# EasyEDA Pro project ProPrj_supercap v0.1_2026-02-15.epro, schematic Schematic1, sheets 4 to 5 of 5

## Sheets
4 P4: Project Name: Project Name; Schematic Name: Schematic Name; Update Date: 2021.11.05
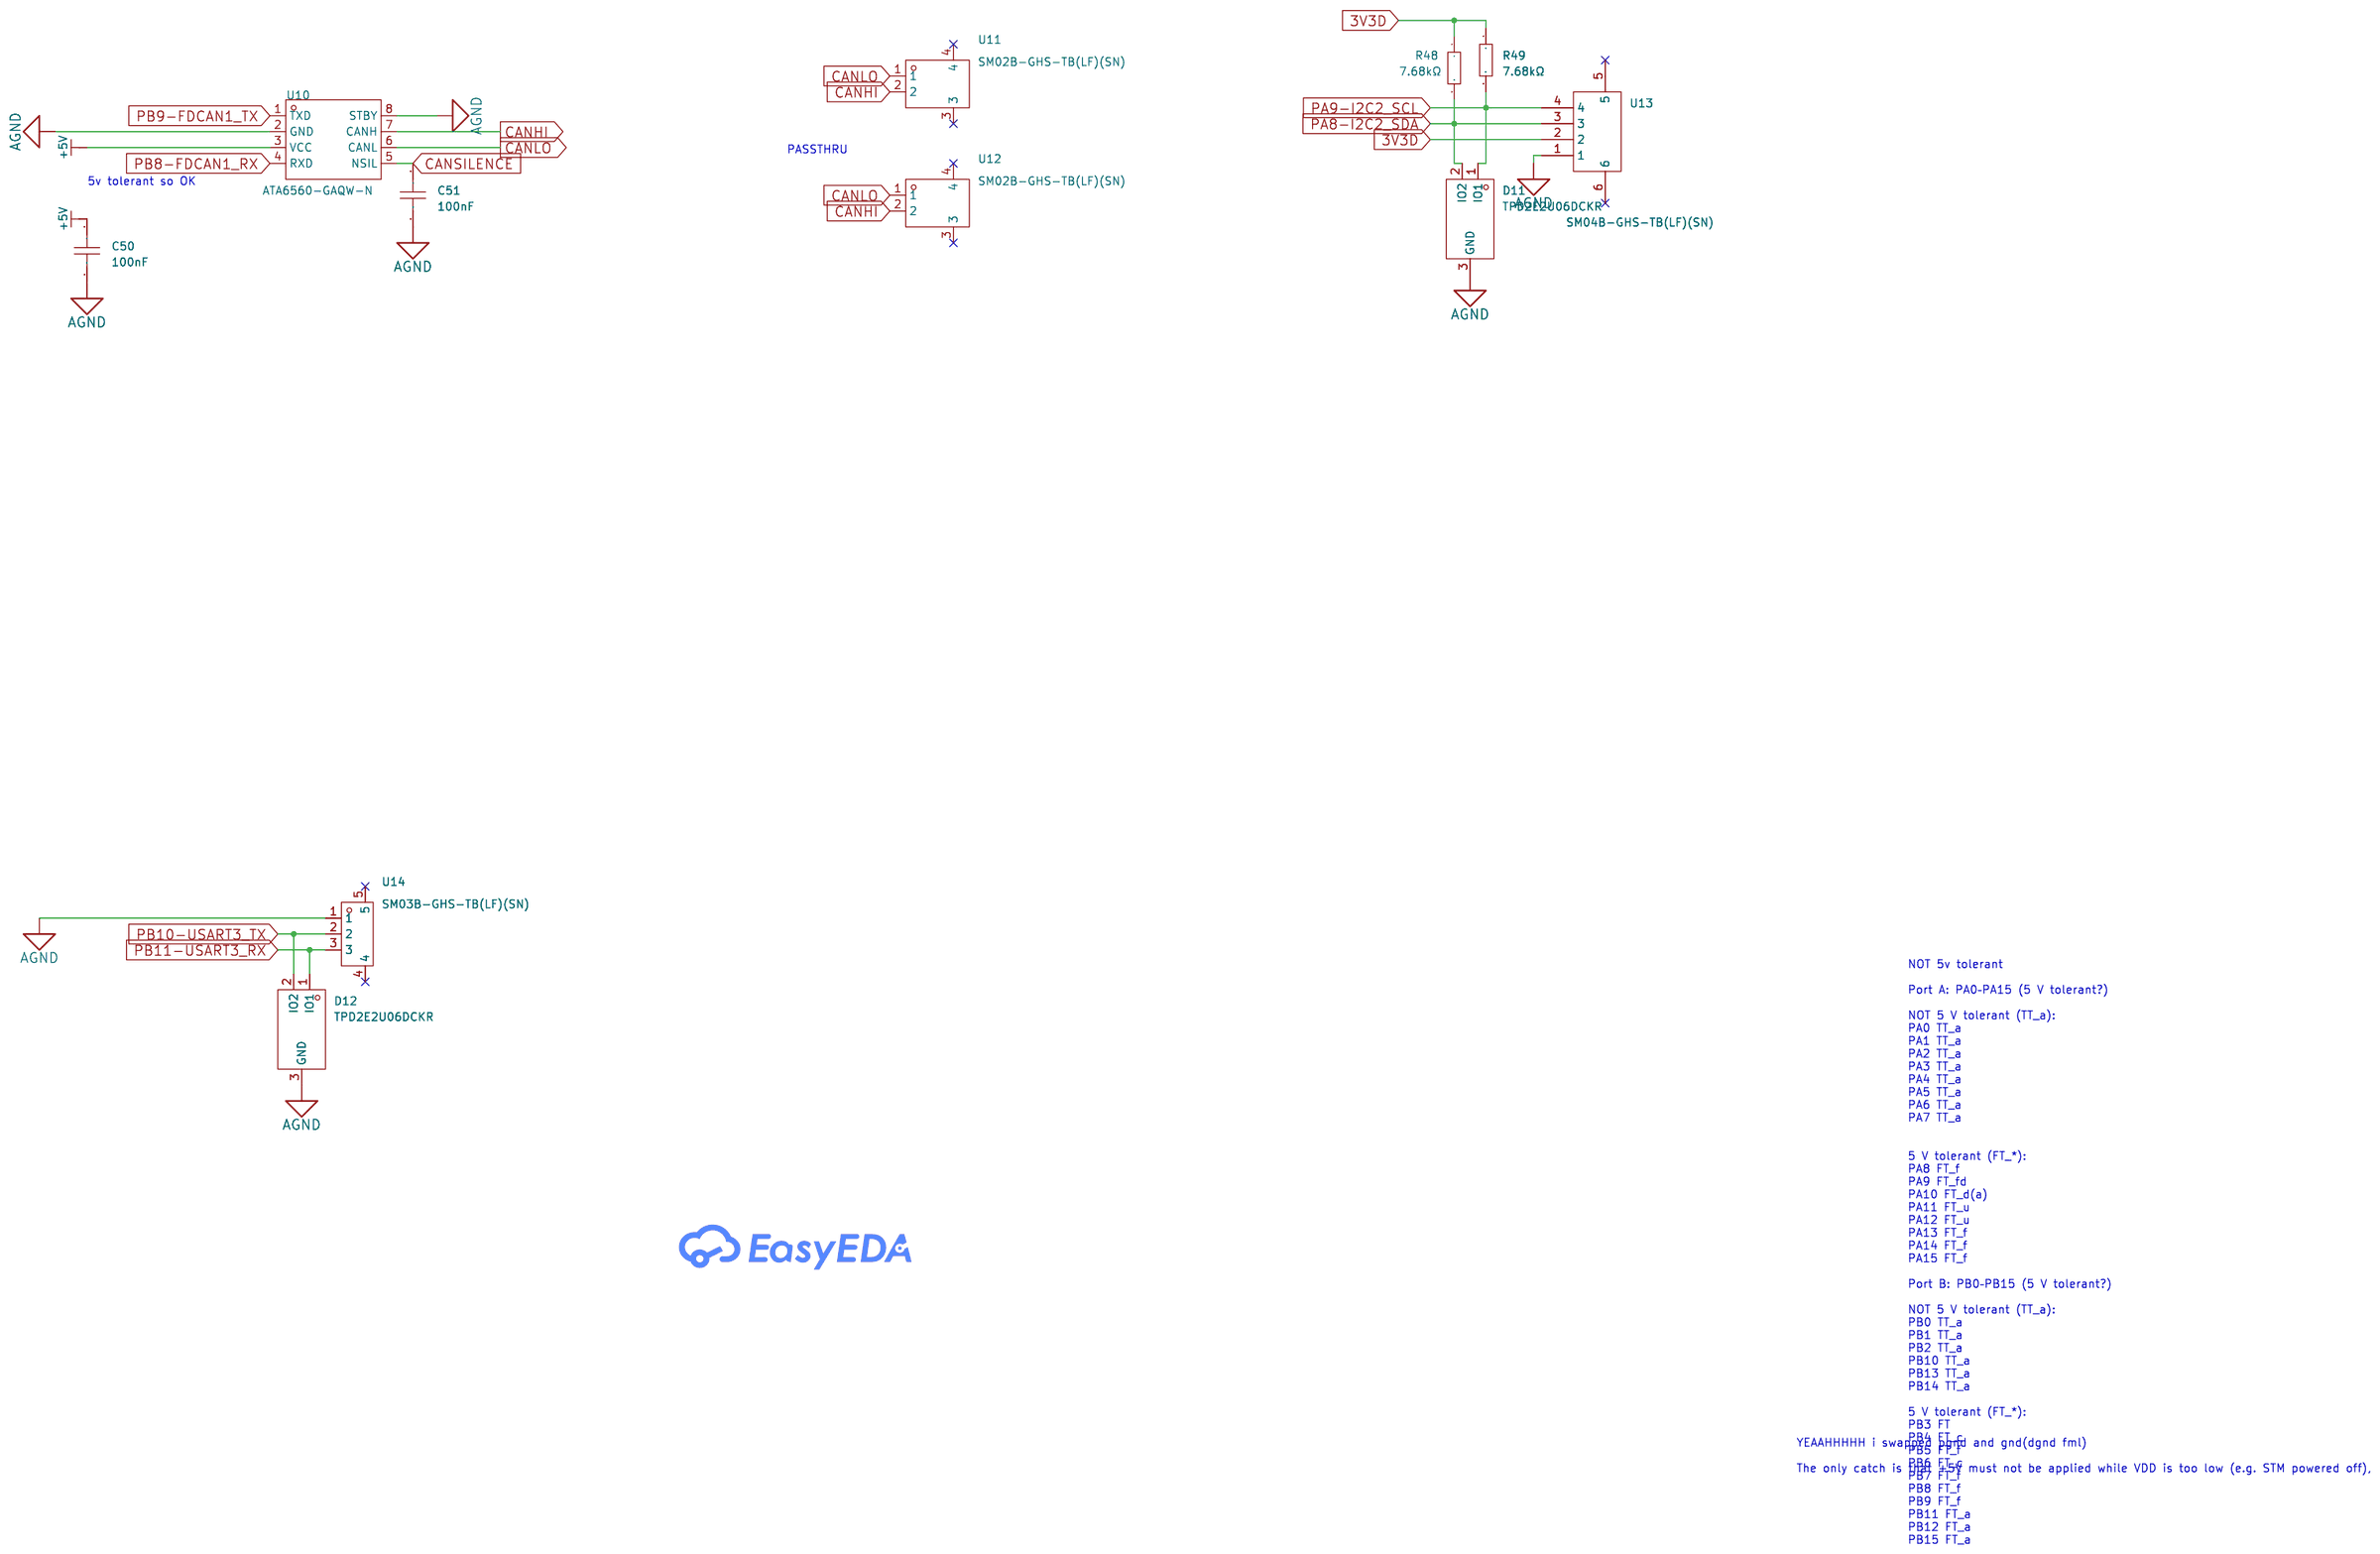
[diagram p3: P4]
5 P5: Create Date: 2026-01-09; Page Name: P5; Update Date: 2026-01-31
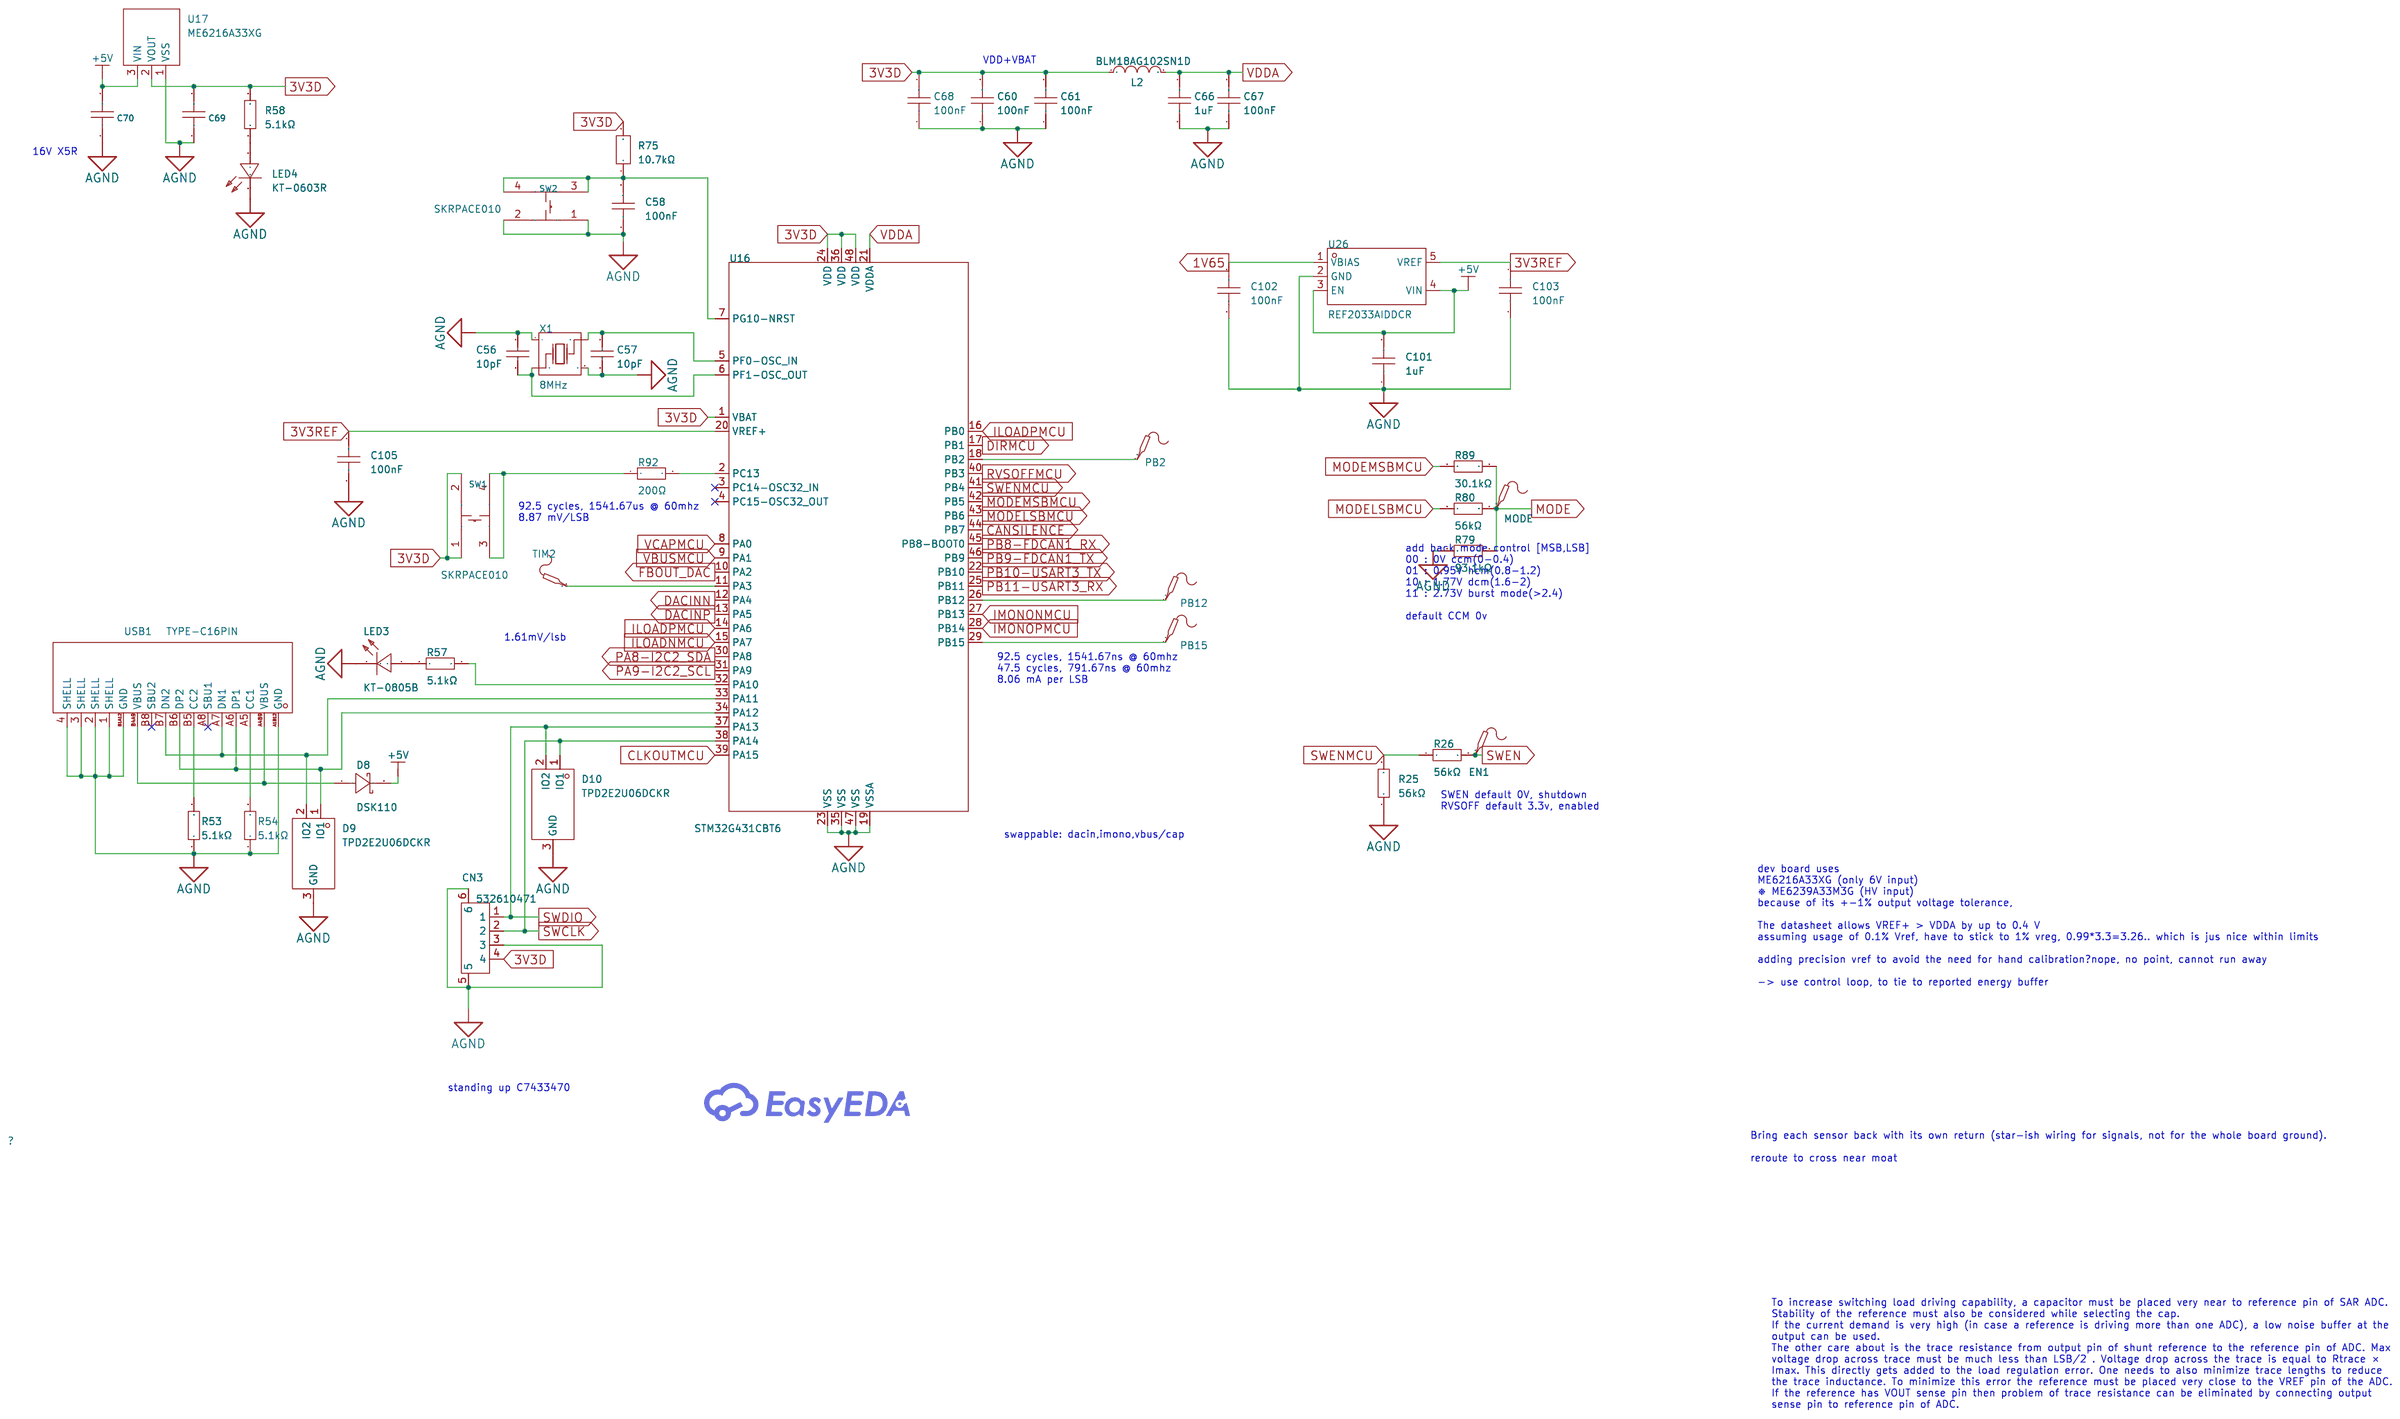
[diagram p4: P5]

## Parts
sheet P4
C50  100nF  [C0603]
C51  100nF  [C0603]
D11  TPD2E2U06DCKR  [SC-70-3_L2.0-W1.3-P0.65-LS2.1-BL]
D12  TPD2E2U06DCKR  [SC-70-3_L2.0-W1.3-P0.65-LS2.1-BL]
R48  7.68kΩ  [R0603]
R49  7.68kΩ  [R0603]
U10  ATA6560-GAQW-N  [SOP-8_L4.9-W3.9-P1.27-LS6.0-BL]
U11  SM02B-GHS-TB(LF)(SN)  [CONN-SMD_SM02B-GHS-TB-LF-SN]
U12  SM02B-GHS-TB(LF)(SN)  [CONN-SMD_SM02B-GHS-TB-LF-SN]
U13  SM04B-GHS-TB(LF)(SN)  [CONN-SMD_4P-P1.25_SM04B-GHS-TB-LF-SN]
U14  SM03B-GHS-TB(LF)(SN)  [CONN-TH_SM03B-GHS-TB-LF-SN]
sheet P5
C56  10pF  [C0603]
C57  10pF  [C0603]
C58  100nF  [C0603]
C60  100nF  [C0603]
C61  100nF  [C0603]
C66  1uF  [C0603]
C67  100nF  [C0603]
C68  100nF  [C0603]
C69  4.7uF  [C0805]
C70  4.7uF  [C0805]
C101  1uF  [C0603]
C102  100nF  [C0603]
C103  100nF  [C0603]
C105  100nF  [C0603]
CN3  532610471  [CONN-SMD_4P-P1.25_53261-0471]
D8  DSK110  [SOD-123_L2.8-W1.8-LS3.7-FD]
D9  TPD2E2U06DCKR  [SC-70-3_L2.0-W1.3-P0.65-LS2.1-BL]
D10  TPD2E2U06DCKR  [SC-70-3_L2.0-W1.3-P0.65-LS2.1-BL]
EN1  -  [Test-Point-0.5mm]
L2  BLM18AG102SN1D  [L0603]
LED3  KT-0805B  [LED0805-R-RD]
LED4  KT-0603R  [LED0603-RD]
MODE  -  [Test-Point-0.5mm]
PB2  -  [Test-Point-0.5mm]
PB12  -  [Test-Point-0.5mm]
PB15  -  [Test-Point-0.5mm]
R25  56kΩ  [R0603]
R26  56kΩ  [R0603]
R53  5.1kΩ  [R0603]
R54  5.1kΩ  [R0603]
R57  5.1kΩ  [R0603]
R58  5.1kΩ  [R0603]
R75  10.7kΩ  [R0603]
R79  93.1kΩ  [R0603]
R80  56kΩ  [R0603]
R89  30.1kΩ  [R0603]
R92  200Ω  [R0603]
SW1  SKRPACE010  [KEY-SMD_4P-L4.2-W3.2-P2.20-LS4.6]
SW2  SKRPACE010  [KEY-SMD_4P-L4.2-W3.2-P2.20-LS4.6]
TIM2  -  [Test-Point-0.5mm]
U16  STM32G431CBT6  [LQFP-48_L7.0-W7.0-P0.50-LS9.0-BL]
U17  ME6216A33XG  [SOT-23-3_L2.9-W1.6-P1.90-LS2.8-BR]
U26  REF2033AIDDCR  [SOT-23-5_L3.0-W1.7-P0.95-LS2.8-BL]
USB1  TYPE-C16PIN  [USB-C-SMD_TYPE-C16PIN]
X1  8MHz  [CRYSTAL-SMD_4P-L3.2-W2.5-BL]

## Library data of the parts
C50 C51 C58 C60 C61 C67 C68 C102 C103 C105 = CL10B104KC8NNNC: Capacitance:100nF Tolerance:±10% Tolerance:±10% Voltage Rating:100V Temperature Coefficient:X7R; LCSC Part Name: 100nF ±10% 100V; Supplier Part: C15725; Manufacturer: SAMSUNG(三星); Supplier Footprint: 0603; JLCPCB Part Class: Extended Part; Datasheet: https://item.szlcsc.com/datasheet/CL10B104KC8NNNC/16407.html; Supplier: LCSC; Tolerance: ±10%; Voltage Rating: 100V; Temperature Coefficient: X7R; Check: true
D9-D12 = TPD2E2U06DCKR: Reverse Stand-Off Voltage (Vrwm):5.5V Maximum Clamping Voltage:12.4V Peak Pulse Current (Ipp):5.5A@8/20us Peak Pulse Power Dissipation (Ppp):75W Breakdown Voltage:6.5V Number of Lines:Dual channel Operating Temperature:-40℃~+125℃@(Ta) Operating Temperatur; Supplier Part: C1855726; Manufacturer: TI(德州仪器); Supplier Footprint: SC-70-3; JLCPCB Part Class: Extended Part; Datasheet: https://www.ti.com/cn/lit/gpn/tpd2e2u06; Supplier: LCSC; Reverse Stand-Off Voltage (Vrwm): 5.5V; Maximum Clamping Voltage: 12.4V; Peak Pulse Current (Ipp): 5.5A@8/20us; Peak Pulse Power Dissipation (Ppp): 75W; Breakdown Voltage: 6.5V; Number of Lines: Dual channel; Operating Temperature: -40℃~+125℃@(Ta); Type: ESD
R48 R49 = RT0603BRD077K68L: Type:Thin Film Resistor Resistance: Tolerance:±0.1% Tolerance:±0.1% Power(Watts): Overload Voltage (Max): Temperature Coefficient:±25ppm/℃ Temperature Coefficient:±25ppm/℃ Operating Temperature Range:-55℃~+155℃ Operating Temperature Range:-55℃~+155℃; LCSC Part Name: 薄膜电阻 7.68kΩ ±0.1% 100mW; Supplier Part: C375517; Manufacturer: YAGEO(国巨); Supplier Footprint: 0603; JLCPCB Part Class: Extended Part; Datasheet: https://atta.szlcsc.com/upload/public/pdf/source/20190227/C375517_CC2D9037C5877ACA9CB8399CF9A8D04C.pdf; Supplier: LCSC; Type: Thin Film Resistor; Tolerance: ±0.1%; Temperature Coefficient: ±25ppm/℃; Operating Temperature Range: -55℃~+155℃; Check: true
U10 = ATA6560-GAQW-N_C2671262: Type:CANtransceiver Data Rate:5Mbps Supply Voltage:4.5V~5.5V Supply Voltage:4.5V~5.5V Operating Temperature:-40℃~+150℃ Operating Temperature:-40℃~+150℃; LCSC Part Name: 高速CAN收发器，具有待机模式; Supplier Part: C2671262; Manufacturer: MICROCHIP(美国微芯); Supplier Footprint: SOP-8; JLCPCB Part Class: Extended Part; Datasheet: https://atta.szlcsc.com/upload/public/pdf/source/20211008/C2671262_D7FCCB811013C7D69A57B5A2D230BAD0.pdf; Supplier: LCSC; Type: CANtransceiver; Data Rate: 5Mbps; Supply Voltage: 4.5V~5.5V; Operating Temperature: -40℃~+150℃; Check: true
U11 U12 = SM02B-GHS-TB(LF)(SN): Pins Structure:1x2P Pitch:1.25mm Mounting Style:Horizontal attachment Reference Series:GH Number of Pins:2P Number of Rows:1 Number of PINs Per Row:2 Row Spacing:- Current Rating (Max):1A Contact Material:Phosphor Bronze Contact Plating:Tin Operating Temp; LCSC Part Name: 1x2P 间距:1.25mm 卧贴 系列:GH; Supplier Part: C189893; Manufacturer: JST; Supplier Footprint: SMD,P=1.25mm,卧贴; JLCPCB Part Class: Extended Part; Datasheet: https://atta.szlcsc.com/upload/public/pdf/source/20180323/112205B2CF875947C9562BFC7B01FA26.pdf; Supplier: LCSC; Pins Structure: 1x2P; Pitch: 1.25mm; Mounting Style: Horizontal attachment; Reference Series: GH; Number of Pins: 2P; Number of Rows: 1; Number of PINs Per Row: 2; Current Rating (Max): 1A; Contact Material: Phosphor Bronze; Contact Plating: Tin; Operating Temperature Range: -25℃~+85℃; Rated Voltage (Max): 50V; Plastic Material: PA9T; Flame Retardant Rating: UL94V-0; Supplementary Features: Auxiliary soldering legs; Colour: White; Z-Height of the Board: 4.25mm; X-Length of Bottom Edge on Board (Spacing Line): 5.75mm; Y-Width of Bottom Edge on Board: 4.13mm; Check: true
U13 = SM04B-GHS-TB(LF)(SN): Pins Structure:1x4P Pitch:1.25mm Mounting Style:Horizontal attachment Reference Series:GH Number of Pins:4P Number of Rows:1 Number of PINs Per Row:4 Row Spacing:- Current Rating (Max):1A Contact Material:Phosphor Bronze Contact Plating:Tin Operating Temp; LCSC Part Name: 1x4P 间距:1.25mm 卧贴 系列:GH; Supplier Part: C189895; Manufacturer: JST; Supplier Footprint: SMD,P=1.25mm,卧贴; JLCPCB Part Class: Extended Part; Datasheet: https://atta.szlcsc.com/upload/public/pdf/source/20180323/112205B2CF875947C9562BFC7B01FA26.pdf; Supplier: LCSC; Pins Structure: 1x4P; Pitch: 1.25mm; Mounting Style: Horizontal attachment; Reference Series: GH; Number of Pins: 4P; Number of Rows: 1; Number of PINs Per Row: 4; Current Rating (Max): 1A; Contact Material: Phosphor Bronze; Contact Plating: Tin; Operating Temperature Range: -25℃~+85℃; Rated Voltage (Max): 50V; Plastic Material: PA9T; Flame Retardant Rating: UL94V-0; Supplementary Features: Auxiliary soldering legs; Colour: White; Z-Height of the Board: 4.25mm; X-Length of Bottom Edge on Board (Spacing Line): 8.25mm; Y-Width of Bottom Edge on Board: 4.13mm; Check: true
U14 = SM03B-GHS-TB(LF)(SN): Pins Structure:1x3P Pitch:1.25mm Mounting Style:Horizontal attachment Reference Series:GH Number of Pins:3P Number of Rows:1 Number of PINs Per Row:3 Row Spacing:- Current Rating (Max):1A Contact Material:Phosphor Bronze Contact Plating:Tin Operating Temp; LCSC Part Name: 1x3P 间距:1.25mm 卧贴 系列:GH; Supplier Part: C514175; Manufacturer: JST; Supplier Footprint: SMD,P=1.25mm,卧贴; JLCPCB Part Class: Extended Part; Datasheet: https://atta.szlcsc.com/upload/public/pdf/source/20200416/C514175_6D761544780BFF1FCAB26BE8A747A99F.pdf; Supplier: LCSC; Pins Structure: 1x3P; Pitch: 1.25mm; Mounting Style: Horizontal attachment; Reference Series: GH; Number of Pins: 3P; Number of Rows: 1; Number of PINs Per Row: 3; Current Rating (Max): 1A; Contact Material: Phosphor Bronze; Contact Plating: Tin; Operating Temperature Range: -25℃~+85℃; Rated Voltage (Max): 50V; Plastic Material: PA9T; Flame Retardant Rating: UL94V-0; Supplementary Features: Auxiliary soldering legs; Colour: White; Z-Height of the Board: 4.25mm; X-Length of Bottom Edge on Board (Spacing Line): 7mm; Y-Width of Bottom Edge on Board: 4.13mm; Check: true
C56 C57 = CL10C100JB8NNNC: Capacitance:10pF Tolerance:±5% Tolerance:±5% Voltage Rating:50V Temperature Coefficient:C0G; LCSC Part Name: 10pF ±5% 50V; Supplier Part: C1634; Manufacturer: SAMSUNG(三星); Supplier Footprint: 0603; JLCPCB Part Class: Basic Part; Datasheet: https://item.szlcsc.com/datasheet/CL10C100JB8NNNC/1986.html; Supplier: LCSC; Tolerance: ±5%; Voltage Rating: 50V; Temperature Coefficient: C0G; Check: true
C66 C101 = CC0603KRX7R9BB105: Capacitance: Tolerance:±10% Tolerance:±10% Voltage Rated: Temperature Coefficient:; LCSC Part Name: 1uF ±10% 50V; Supplier Part: C559769; Manufacturer: YAGEO(国巨); Supplier Footprint: 0603; JLCPCB Part Class: Extended Part; Datasheet: https://atta.szlcsc.com/upload/public/pdf/source/20181031/C325451_C7CF01155AE3010E0D610C52F5FE7D31.pdf; Supplier: LCSC; Tolerance: ±10%; Check: true
C69 C70 = GRM21BZ71H475KE15L: Capacitance:4.7uF Tolerance:±10% Tolerance:±10% Voltage Rating:50V Temperature Coefficient:X7R; LCSC Part Name: 4.7uF ±10% 50V; Supplier Part: C437557; Manufacturer: muRata(村田); Supplier Footprint: 0805; JLCPCB Part Class: Extended Part; Datasheet: https://item.szlcsc.com/datasheet/GRM21BZ71H475KE15L/436012.html; Supplier: LCSC; Tolerance: ±10%; Voltage Rating: 50V; Temperature Coefficient: X7R
CN3 = 532610471_C696092: Pins Structure:1x4P Pitch:1.25mm Mounting Style:Horizontal attachment Reference Series:PicoBlade(MX 1.25) Number of Pins:4P Number of Rows:1 Number of PINs Per Row:4 Row Spacing:- Current Rating (Max):1A Contact Material:Phosphor Bronze Contact Plating:Ti; LCSC Part Name: 1x4P 间距:1.25mm 卧贴 系列:PicoBlade(MX 1.25); Supplier Part: C696092; Manufacturer: MOLEX; Supplier Footprint: SMD,P=1.25mm; JLCPCB Part Class: Extended Part; Datasheet: https://www.molex.com/content/dam/molex/molex-dot-com/products/automated/en-us/salesdrawingpdf/532/53261/532610471_sd.pdf?inline; Supplier: LCSC; Pins Structure: 1x4P; Pitch: 1.25mm; Mounting Style: Horizontal attachment; Reference Series: PicoBlade(MX 1.25); Number of Pins: 4P; Number of Rows: 1; Number of PINs Per Row: 4; Current Rating (Max): 1A; Contact Material: Phosphor Bronze; Contact Plating: Tin; Operating Temperature Range: -40℃~+105℃; Rated Voltage (Max): 125V; Plastic Material: 玻纤增强PA; Flame Retardant Rating: UL94V-0; Supplementary Features: Auxiliary soldering legs; Colour: White; Z-Height of the Board: 3.4mm; X-Length of Bottom Edge on Board (Spacing Line): 10.15mm; Y-Width of Bottom Edge on Board: 5.2mm; Check: true
D8 = DSK110_C908227: Diode Configuration:- Voltage - Forward(Vf@If):850mV@1A Voltage - DC Reverse(Vr):100V Current - Rectified:1A Reverse Leakage Current (Ir):500nA Operating Junction Temperature Range:-55℃~+150℃ Operating Junction Temperature Range:-55℃~+150℃ Non-Repetitive; LCSC Part Name: 电压:100V 电流:1A; Supplier Part: C908227; Manufacturer: FUXINSEMI(富芯森美); Supplier Footprint: SOD-123; JLCPCB Part Class: Extended Part; Datasheet: https://item.szlcsc.com/datasheet/DSK110/974469.html; Supplier: LCSC; Forward Voltage (Vf@If): 850mV@1A; Reverse Voltage (Vr): 100V; Rectified Current: 1A; Reverse Leakage Current (Ir): 500nA; Voltage - Forward(Vf@If): 850mV@1A; Voltage - DC Reverse(Vr): 100V; Current - Rectified: 1A; Non-Repetitive Peak Forward Surge Current: 25A; Operating Junction Temperature Range: -55℃~+150℃
EN1 = Test-Point: Test Point 测试点; Check: true
L2 = BLM18AG102SN1D: Impedance @ Frequency:1kΩ@100MHz Tolerance:±25% Tolerance:±25% DC Resistance:500mΩ Current Rating:450mA Circuits:1; LCSC Part Name: 单路 0603磁珠 阻抗1kΩ@100MHz; Supplier Part: C85824; Manufacturer: muRata(村田); Supplier Footprint: 0603; JLCPCB Part Class: Extended Part; Datasheet: https://atta.szlcsc.com/upload/public/pdf/source/20180329/C160981_FD3C2D2622A377E203B89F4AA32B0741.pdf; Supplier: LCSC; Impedance @ Frequency: 1kΩ@100MHz; Tolerance: ±25%; DC Resistance: 500mΩ; Current Rating: 450mA; Circuits: 1
LED3 = KT-0805B: LCSC Part Name: 0805 蓝灯 高亮; Supplier Part: C2293; Manufacturer: KENTO; Supplier Footprint: 0805; JLCPCB Part Class: Extended Part; Datasheet: https://atta.szlcsc.com/upload/public/pdf/source/20150723/1457707334170.pdf; Supplier: LCSC
LED4 = KT-0603R: Emitted Color:Red Power Dissipation:- Forward Current:- Dominant Wavelength:- Dominant Wavelength:- Peak Wavelength:- Diode Configuration:- Lens Color:- Color Temperature:- Color Temperature:- Viewing Angle:- Mounting Sytle:- Operating Temperature:-40℃~+8; LCSC Part Name: 0603 红灯 高亮; Supplier Part: C2286; Manufacturer: KENTO; Supplier Footprint: 0603; JLCPCB Part Class: Basic Part; Datasheet: https://atta.szlcsc.com/upload/public/pdf/source/20160616/1466072038404.pdf; Supplier: LCSC; Emitted Color: Red; Operating Temperature: -40℃~+85℃
MODE PB2 PB12 PB15 TIM2 = Test-Point: Test Point 测试点
R25 R26 R80 = RC0603FR-0756KL: Type:Thick Film Resistors Resistance: Tolerance:±1% Tolerance:±1% Power(Watts): Overload Voltage (Max): Temperature Coefficient:±100ppm/℃ Temperature Coefficient:±100ppm/℃ Operating Temperature Range:-55℃~+155℃ Operating Temperature Range:-55℃~+155℃; LCSC Part Name: 厚膜电阻 56kΩ ±1% 100mW; Supplier Part: C114630; Manufacturer: YAGEO(国巨); Supplier Footprint: 0603; JLCPCB Part Class: Extended Part; Datasheet: https://atta.szlcsc.com/upload/public/pdf/source/20180821/C275644_0D56F95EFF785E7D9A1FEF436B37DA78.pdf; Supplier: LCSC; Type: Thick Film Resistors; Tolerance: ±1%; Temperature Coefficient: ±100ppm/℃; Operating Temperature Range: -55℃~+155℃
R53 R54 R57 R58 = RC0603FR-075K1L: Type:Thick Film Resistors Resistance:5.1kΩ Tolerance:±1% Tolerance:±1% Power(Watts):100mW Voltage-Supply(Max):75V Temperature Coefficient:±100ppm/℃ Temperature Coefficient:±100ppm/℃ Operating Temperature:-55℃~+155℃ Operating Temperature:-55℃~+155℃; LCSC Part Name: 厚膜电阻 5.1kΩ ±1% 100mW; Supplier Part: C105580; Manufacturer: YAGEO(国巨); Supplier Footprint: 0603; JLCPCB Part Class: Extended Part; Datasheet: https://item.szlcsc.com/datasheet/RC0603FR-075K1L/106795.html; Supplier: LCSC; Type: Thick Film Resistors; Tolerance: ±1%; Power(Watts): 100mW; Voltage-Supply(Max): 75V; Temperature Coefficient: ±100ppm/℃; Operating Temperature: -55℃~+155℃
R75 = RC0603FR-0710K7L: Type:Thick Film Resistors Resistance: Tolerance:±1% Tolerance:±1% Power(Watts): Overload Voltage (Max): Temperature Coefficient:±100ppm/℃ Temperature Coefficient:±100ppm/℃ Operating Temperature Range:-55℃~+155℃ Operating Temperature Range:-55℃~+155℃; LCSC Part Name: 厚膜电阻 10.7kΩ ±1% 100mW; Supplier Part: C482766; Manufacturer: YAGEO(国巨); Supplier Footprint: 0603; JLCPCB Part Class: Extended Part; Datasheet: https://atta.szlcsc.com/upload/public/pdf/source/20200715/C482766_42FE1960139F246AEBCCBE4167A6CC88.pdf; Supplier: LCSC; Type: Thick Film Resistors; Tolerance: ±1%; Temperature Coefficient: ±100ppm/℃; Operating Temperature Range: -55℃~+155℃
R79 = AC0603FR-0793K1L: Type:Thick Film Resistor Resistance:93.1kΩ Tolerance:±1% Tolerance:±1% Power(Watts):100mW Voltage-Supply(Max):75V Temperature Coefficient:±100ppm/℃ Temperature Coefficient:±100ppm/℃ Operating Temperature:-55℃~+155℃ Operating Temperature:-55℃~+155℃; LCSC Part Name: 厚膜电阻 93.1kΩ ±1% 100mW; Supplier Part: C228101; Manufacturer: YAGEO(国巨); Supplier Footprint: 0603; JLCPCB Part Class: Extended Part; Datasheet: https://item.szlcsc.com/datasheet/AC0603FR-0793K1L/228326.html; Supplier: LCSC; Type: Thick Film Resistor; Tolerance: ±1%; Power(Watts): 100mW; Voltage-Supply(Max): 75V; Temperature Coefficient: ±100ppm/℃; Operating Temperature: -55℃~+155℃
R89 = RC0603FR-0730K1L: Type:Thick Film Resistors Resistance: Tolerance:±1% Tolerance:±1% Power(Watts): Overload Voltage (Max): Temperature Coefficient:±100ppm/℃ Temperature Coefficient:±100ppm/℃ Operating Temperature Range:-55℃~+155℃ Operating Temperature Range:-55℃~+155℃; LCSC Part Name: 厚膜电阻 30.1kΩ ±1% 100mW; Supplier Part: C137745; Manufacturer: YAGEO(国巨); Supplier Footprint: 0603; JLCPCB Part Class: Extended Part; Datasheet: https://atta.szlcsc.com/upload/public/pdf/source/20180821/C275644_0D56F95EFF785E7D9A1FEF436B37DA78.pdf; Supplier: LCSC; Type: Thick Film Resistors; Tolerance: ±1%; Temperature Coefficient: ±100ppm/℃; Operating Temperature Range: -55℃~+155℃
R92 = RC0603FR-07200RL: Type:Thick Film Resistors Resistance: Tolerance:±1% Tolerance:±1% Power(Watts): Overload Voltage (Max): Temperature Coefficient:±100ppm/℃ Temperature Coefficient:±100ppm/℃ Operating Temperature Range:-55℃~+155℃ Operating Temperature Range:-55℃~+155℃; LCSC Part Name: 厚膜电阻 200Ω ±1% 100mW; Supplier Part: C114664; Manufacturer: YAGEO(国巨); Supplier Footprint: 0603; JLCPCB Part Class: Extended Part; Datasheet: https://atta.szlcsc.com/upload/public/pdf/source/20180821/C275644_0D56F95EFF785E7D9A1FEF436B37DA78.pdf; Supplier: LCSC; Type: Thick Film Resistors; Tolerance: ±1%; Temperature Coefficient: ±100ppm/℃; Operating Temperature Range: -55℃~+155℃; Check: true
SW1 SW2 = SKRPACE010: Circuit:SPST Actuator Style:Oval Button Mounting Type:Surface Mount,Vertical Length:4.2mm Width:3.2mm Switch Height:2.5mm Contact Current:50mA Voltage Rating:16V With Lamp:- Life:-; LCSC Part Name: 4.2*3.2*2.5mm 立贴 轻触开关; Supplier Part: C139797; Manufacturer: ALPSALPINE(阿尔卑斯阿尔派); Supplier Footprint: SMD-4P,4.2x3.2mm; JLCPCB Part Class: Extended Part; Datasheet: https://item.szlcsc.com/datasheet/SKRPACE010/151122.html; Supplier: LCSC; Circuit: SPST; Actuator Style: Oval Button; Mounting Type: Surface Mount,Vertical; Length: 4.2mm; Width: 3.2mm; Switch Height: 2.5mm; Contact Current: 50mA; Voltage Rating: 16V; Check: true
U16 = STM32G431CBT6: CPU Core:ARM Cortex-M Series CPU Maximum Speed:170MHz Program Storage Size:128KB Program Memory Type:FLASH Number of I/O:38 ADC (Bit):12bit DAC (Bit):12bit Voltage - Supply:1.71V~3.6V Voltage - Supply:1.71V~3.6V Applications:-; LCSC Part Name: 带DSP和FPU的170MHz主流ARM Cortex-M4 MCU，具有128 KB Flash存储器、数学加速器和中等模拟电平集成; Supplier Part: C529355; Manufacturer: ST(意法半导体); Supplier Footprint: LQFP-48(7x7); JLCPCB Part Class: Extended Part; Datasheet: https://item.szlcsc.com/datasheet/STM32G431CBT6/549633.html; Supplier: LCSC; CPU Core: ARM Cortex-M Series; CPU Maximum Speed: 170MHz; Program Storage Size: 128KB; Program Memory Type: FLASH; Number of I/O: 38; ADC (Bit): 12bit; DAC (Bit): 12bit; Voltage - Supply: 1.71V~3.6V; Check: true
U17 = ME6216A33XG: Output Type:Fixed Voltage - Supply:6V Output Voltage:3.3V Output Voltage:3.3V Output Current:350mA Power Supply Rejection Ratio (PSRR):65dB@(1kHz) Voltage Dropout:120mV@(100mA) standby current:8uA Features:Over Current Protection；Short Circuit Protection; LCSC Part Name: 输入6V 输出3.3V 250mA; Supplier Part: C236655; Manufacturer: MICRONE(南京微盟); Supplier Footprint: SOT-23; JLCPCB Part Class: Extended Part; Datasheet: https://item.szlcsc.com/datasheet/ME6216A33XG/236095.html; Supplier: LCSC; Output Type: Fixed; Voltage - Supply: 6V; Output Voltage: 3.3V; Output Current: 350mA; Power Supply Rejection Ratio (PSRR): 65dB@(1kHz); Voltage Dropout: 120mV@(100mA); standby current: 8uA; Features: Over Current Protection；Short Circuit Protection; Operating Temperature: -25℃~+125℃@(Ta); Output Configuration: Positive; Number of Outputs: 1
U26 = REF2033AIDDCR: Output Type:Fixed Voltage - Supply:3.32V~5.5V Voltage - Supply:3.32V~5.5V Output Voltage:3.3V Output Voltage:3.3V Output Current:20mA Tolerance:±0.05% Tolerance:±0.05% Temperature Coefficient:8ppm/℃ Reference Type:Series Quiescent Current:360uA Operating; LCSC Part Name: 3.32V~5.5V 串联 360uA 8ppm/℃; Supplier Part: C440747; Manufacturer: TI(德州仪器); Supplier Footprint: SOT-23-5; JLCPCB Part Class: Extended Part; Datasheet: https://www.ti.com/cn/lit/gpn/ref2033; Supplier: LCSC; Output Type: Fixed; Voltage - Supply: 3.32V~5.5V; Output Voltage: 3.3V; Output Current: 20mA; Tolerance: ±0.05%; Temperature Coefficient: 8ppm/℃; Reference Type: Series; Quiescent Current: 360uA; Operating Temperature: -40℃~+125℃
USB1 = TYPE-C16PIN: Connector Type:Type-C Protocol Standard:USB 3.1 Gender:Female Mounting Type:Surface Mount, Right Angle Number of Contacts:16P Number of Ports:1 Current Rating-Power:3A Voltage Rating:30V Connect-Disconnect Life:10,000 Cycles Detection color:Black Operatin; LCSC Part Name: Type-C 母 卧贴; Supplier Part: C393939; Manufacturer: SHOU HAN(首韩); Supplier Footprint: SMD; JLCPCB Part Class: Extended Part; Datasheet: https://item.szlcsc.com/datasheet/TYPE-C16PIN/372551.html; Supplier: LCSC; Connector Type: Type-C; Protocol Standard: USB 3.1; Gender: Female; Mounting Type: Surface Mount, Right Angle; Number of Contacts: 16P; Number of Ports: 1; Current Rating-Power: 3A; Voltage Rating: 30V; Connect-Disconnect Life: 10,000 Cycles; Detection color: Black; Operating Temperature: -40℃~+85℃; Check: true
X1 = TAXM8M4RDBCCT2T: Type:Crystal Oscillator Frequency:8MHz Normal temperature Frequency Tolerance:±10ppm Normal temperature Frequency Tolerance:±10ppm Load Capacitance:10pF Frequency Stability:±15ppm Frequency Stability:±15ppm Equivalent Series Resistance(ESR):250Ω Operating; LCSC Part Name: 8MHz ±10ppm 10pF; Supplier Part: C400090; Manufacturer: YJX(雅晶鑫); Supplier Footprint: SMD3225-4P; JLCPCB Part Class: Extended Part; Datasheet: https://item.szlcsc.com/datasheet/TAXM8M4RDBCCT2T/383475.html; Supplier: LCSC; Type: Crystal Oscillator; Normal temperature Frequency Tolerance: ±10ppm; Load Capacitance: 10pF; Frequency Stability: ±15ppm; Equivalent Series Resistance(ESR): 250Ω; Operating Temperature: -40℃~+85℃; Check: true

## Nets
1V65: C102.1 U26.1(VBIAS) ; also on sheet 3
3V3D: C60.2 C61.2 C68.2 C69.2 CN3.4 L2.1 R48.1 R49.1 R58.2 R75.2 SW1.1 SW1.2 U13.2 U16.1(VBAT) U16.24(VDD) U16.36(VDD) U16.48(VDD) U17.2(VOUT) ; also on sheet 1
3V3REF: C103.1 C105.1 U16.20(VREF+) U26.5(VREF)
+5V: C50.2 C70.2 C101.2 D8.2(K) U10.3(VCC) U17.3(VIN) U26.3(EN) U26.4(VIN) ; also on sheet 3
AGND: C50.1 C51.1 C56.2 C57.1 C58.1 C60.1 C61.1 C66.2 C67.1 C68.1 C69.1 C70.1 C101.1 C102.2 C103.2 C105.2 CN3.3 CN3.5 CN3.6 D9.3(GND) D10.3(GND) D11.3(GND) D12.3(GND) LED3.2(K) LED4.1(K) R25.1 R53.1 R54.1 R79.1 SW2.1 SW2.2 U10.2(GND) U10.8(STBY) U13.1 U14.1 U16.19(VSSA) U16.23(VSS) U16.35(VSS) U16.47(VSS) U17.1(VSS) U26.2(GND) USB1.1(SHELL) USB1.2(SHELL) USB1.3(SHELL) USB1.4(SHELL) USB1.A1B12(GND) USB1.B1A12(GND) X1.2 X1.4 ; also on sheet 1 2 3
VBUSMCU: U16.9(PA1) ; also on sheet 1
VDDA: C66.1 C67.2 L2.2 U16.21(VDDA)
CANHI: U10.7(CANH) U11.2 U12.2
CANLO: U10.6(CANL) U11.1 U12.1
CANSILENCE: C51.2 U10.5(NSIL) U16.44(PB7)
CLKOUTMCU: U16.39(PA15) ; also on sheet 2
DACINN: U16.12(PA4) ; also on sheet 2
DACINP: U16.13(PA5) ; also on sheet 2
DIRMCU: U16.17(PB1) ; also on sheet 1 2
FBOUT_DAC: U16.10(PA2) ; also on sheet 1
ILOADNMCU: U16.15(PA7) ; also on sheet 3
ILOADPMCU: U16.14(PA6) U16.16(PB0) ; also on sheet 3
IMONONMCU: U16.27(PB13) ; also on sheet 2
IMONOPMCU: U16.28(PB14) ; also on sheet 2
MODE: MODE.1 R79.2 R80.2 R89.1 ; also on sheet 2
MODELSBMCU: R80.1 U16.43(PB6)
MODEMSBMCU: R89.2 U16.42(PB5)
PA8-I2C2_SDA: D11.2(IO2) R48.2 U13.3 U16.30(PA8)
PA9-I2C2_SCL: D11.1(IO1) R49.2 U13.4 U16.31(PA9)
PB8-FDCAN1_RX: U10.4(RXD) U16.45(PB8-BOOT0)
PB9-FDCAN1_TX: U10.1(TXD) U16.46(PB9)
PB10-USART3_TX: D12.2(IO2) U14.2 U16.22(PB10)
PB11-USART3_RX: D12.1(IO1) U14.3 U16.25(PB11)
RVSOFFMCU: U16.40(PB3) ; also on sheet 2
SWCLK: CN3.2 D10.1(IO1) U16.38(PA14)
SWDIO: CN3.1 D10.2(IO2) U16.37(PA13)
SWEN: EN1.1 R26.2 ; also on sheet 2
SWENMCU: R25.2 R26.1 U16.41(PB4)
VCAPMCU: U16.8(PA0) ; also on sheet 1
$5N1318: D9.1(IO1) U16.34(PA12) USB1.A6(DP1) USB1.B6(DP2)
$5N1324: D9.2(IO2) U16.33(PA11) USB1.A7(DN1) USB1.B7(DN2)
$5N1336: R54.2 USB1.A5(CC1)
$5N1339: R53.2 USB1.B5(CC2)
$5N1407: D8.1(A) USB1.A4B9(VBUS) USB1.B4A9(VBUS)
$5N1904: C56.1 U16.6(PF1-OSC_OUT) X1.1
$5N1911: C57.2 U16.5(PF0-OSC_IN) X1.3
$5N3772: LED3.1(A) R57.1
$5N4520: R92.2 U16.2(PC13)
$5N4527: R92.1 SW1.3 SW1.4
$5N4702: R57.2 U16.32(PA10)
$5N5349: LED4.2(A) R58.1
$5N7806: C58.2 R75.1 SW2.3 SW2.4 U16.7(PG10-NRST)
$5N9867: TIM2.1 U16.11(PA3)
$5N9964: PB2.1 U16.18(PB2)
$5N9985: PB12.1 U16.26(PB12)
Net-(PB15-1): PB15.1 U16.29(PB15)

Not connected (* = marked no-connect by the designer): U11 3* 4*; U12 3* 4*; U13 5* 6*; U14 4* 5*; U16 3(PC14-OSC32_IN)* 4(PC15-OSC32_OUT)*; USB1 A8(SBU1)* B8(SBU2)*

## Notes on the sheets
sheet 4
- PASSTHRU
- 5v tolerant so OK
- YEAAHHHHH i swapped pgnd and gnd(dgnd fml)
  The only catch is that +5V must not be applied while VDD is too low (e.g. STM powered off),
- NOT 5v tolerant
  Port A: PA0–PA15 (5 V tolerant?)
  NOT 5 V tolerant (TT_a):
  PA0 TT_a
  PA1 TT_a
  PA2 TT_a
  PA3 TT_a
  PA4 TT_a
  PA5 TT_a
  PA6 TT_a
  PA7 TT_a
  5 V tolerant (FT_*):
  PA8 FT_f
  PA9 FT_fd
  PA10 FT_d(a)
  PA11 FT_u
  PA12 FT_u
  PA13 FT_f
  PA14 FT_f
  PA15 FT_f
  Port B: PB0–PB15 (5 V tolerant?)
  NOT 5 V tolerant (TT_a):
  PB0 TT_a
  PB1 TT_a
  PB2 TT_a
  PB10 TT_a
  PB13 TT_a
  PB14 TT_a
  5 V tolerant (FT_*):
  PB3 FT
  PB4 FT_c
  PB5 FT_f
  PB6 FT_c
  PB7 FT_f
  PB8 FT_f
  PB9 FT_f
  PB11 FT_a
  PB12 FT_a
  PB15 FT_a
sheet 5
- VDD+VBAT
- 16V X5R
- 92.5 cycles, 1541.67us @ 60mhz
  8.87 mV/LSB
- add back mode control [MSB,LSB]
  00 : 0V ccm(0-0.4)
  01 : 0.95V hcm(0.8-1.2)
  10 : 1.77V dcm(1.6-2)
  11 : 2.73V burst mode(>2.4)
  default CCM 0v
- 1.61mV/lsb
- 92.5 cycles, 1541.67ns @ 60mhz
  47.5 cycles, 791.67ns @ 60mhz
  8.06 mA per LSB
- SWEN default 0V, shutdown
  RVSOFF default 3.3v, enabled
- swappable: dacin,imono,vbus/cap
- dev board uses
  ME6216A33XG (only 6V input)
  ※ ME6239A33M3G (HV input)
  because of its +-1% output voltage tolerance,
  The datasheet allows VREF+ > VDDA by up to 0.4 V
  assuming usage of 0.1% Vref, have to stick to 1% vreg, 0.99*3.3=3.26.. which is jus nice within limits
  adding precision vref to avoid the need for hand calibration?nope, no point, cannot run away
  -> use control loop, to tie to reported energy buffer
- standing up C7433470
- Bring each sensor back with its own return (star-ish wiring for signals, not for the whole board ground).
  reroute to cross near moat
- To increase switching load driving capability, a capacitor must be placed very near to reference pin of SAR ADC.
  Stability of the reference must also be considered while selecting the cap.
  If the current demand is very high (in case a reference is driving more than one ADC), a low noise buffer at the
  output can be used.
  The other care about is the trace resistance from output pin of shunt reference to the reference pin of ADC. Max
  voltage drop across trace must be much less than LSB/2 . Voltage drop across the trace is equal to Rtrace ×
  Imax. This directly gets added to the load regulation error. One needs to also minimize trace lengths to reduce
  the trace inductance. To minimize this error the reference must be placed very close to the VREF pin of the ADC.
  If the reference has VOUT sense pin then problem of trace resistance can be eliminated by connecting output
  sense pin to reference pin of ADC.
